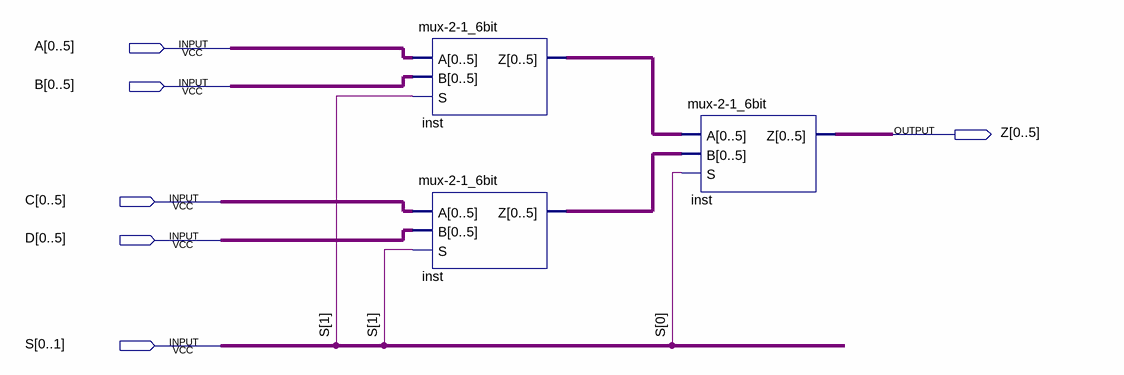
[diagram p0: schematic sheet]
// Quartus schematic mux-4-1_6bit.bdf as structural Verilog: 3 symbols, 6 pins
module \mux-4-1_6bit  (
  input  [0:5] A,
  input  [0:5] B,
  input  [0:5] C,
  input  [0:5] D,
  input  [0:1] S,
  output [0:5] Z
);

  wire [5:0] inst_z, inst_z_2;

  \mux-2-1_6bit  inst (.A(A), .B(B), .S(S[1]), .Z(inst_z_2));
  \mux-2-1_6bit  inst_dup2 (.A(C), .B(D), .S(S[1]), .Z(inst_z));
  \mux-2-1_6bit  inst_dup3 (.A(inst_z_2), .B(inst_z), .S(S[0]), .Z(Z));
endmodule
